# EAGLE schematic motherboard (EAGLE 9.5.2)
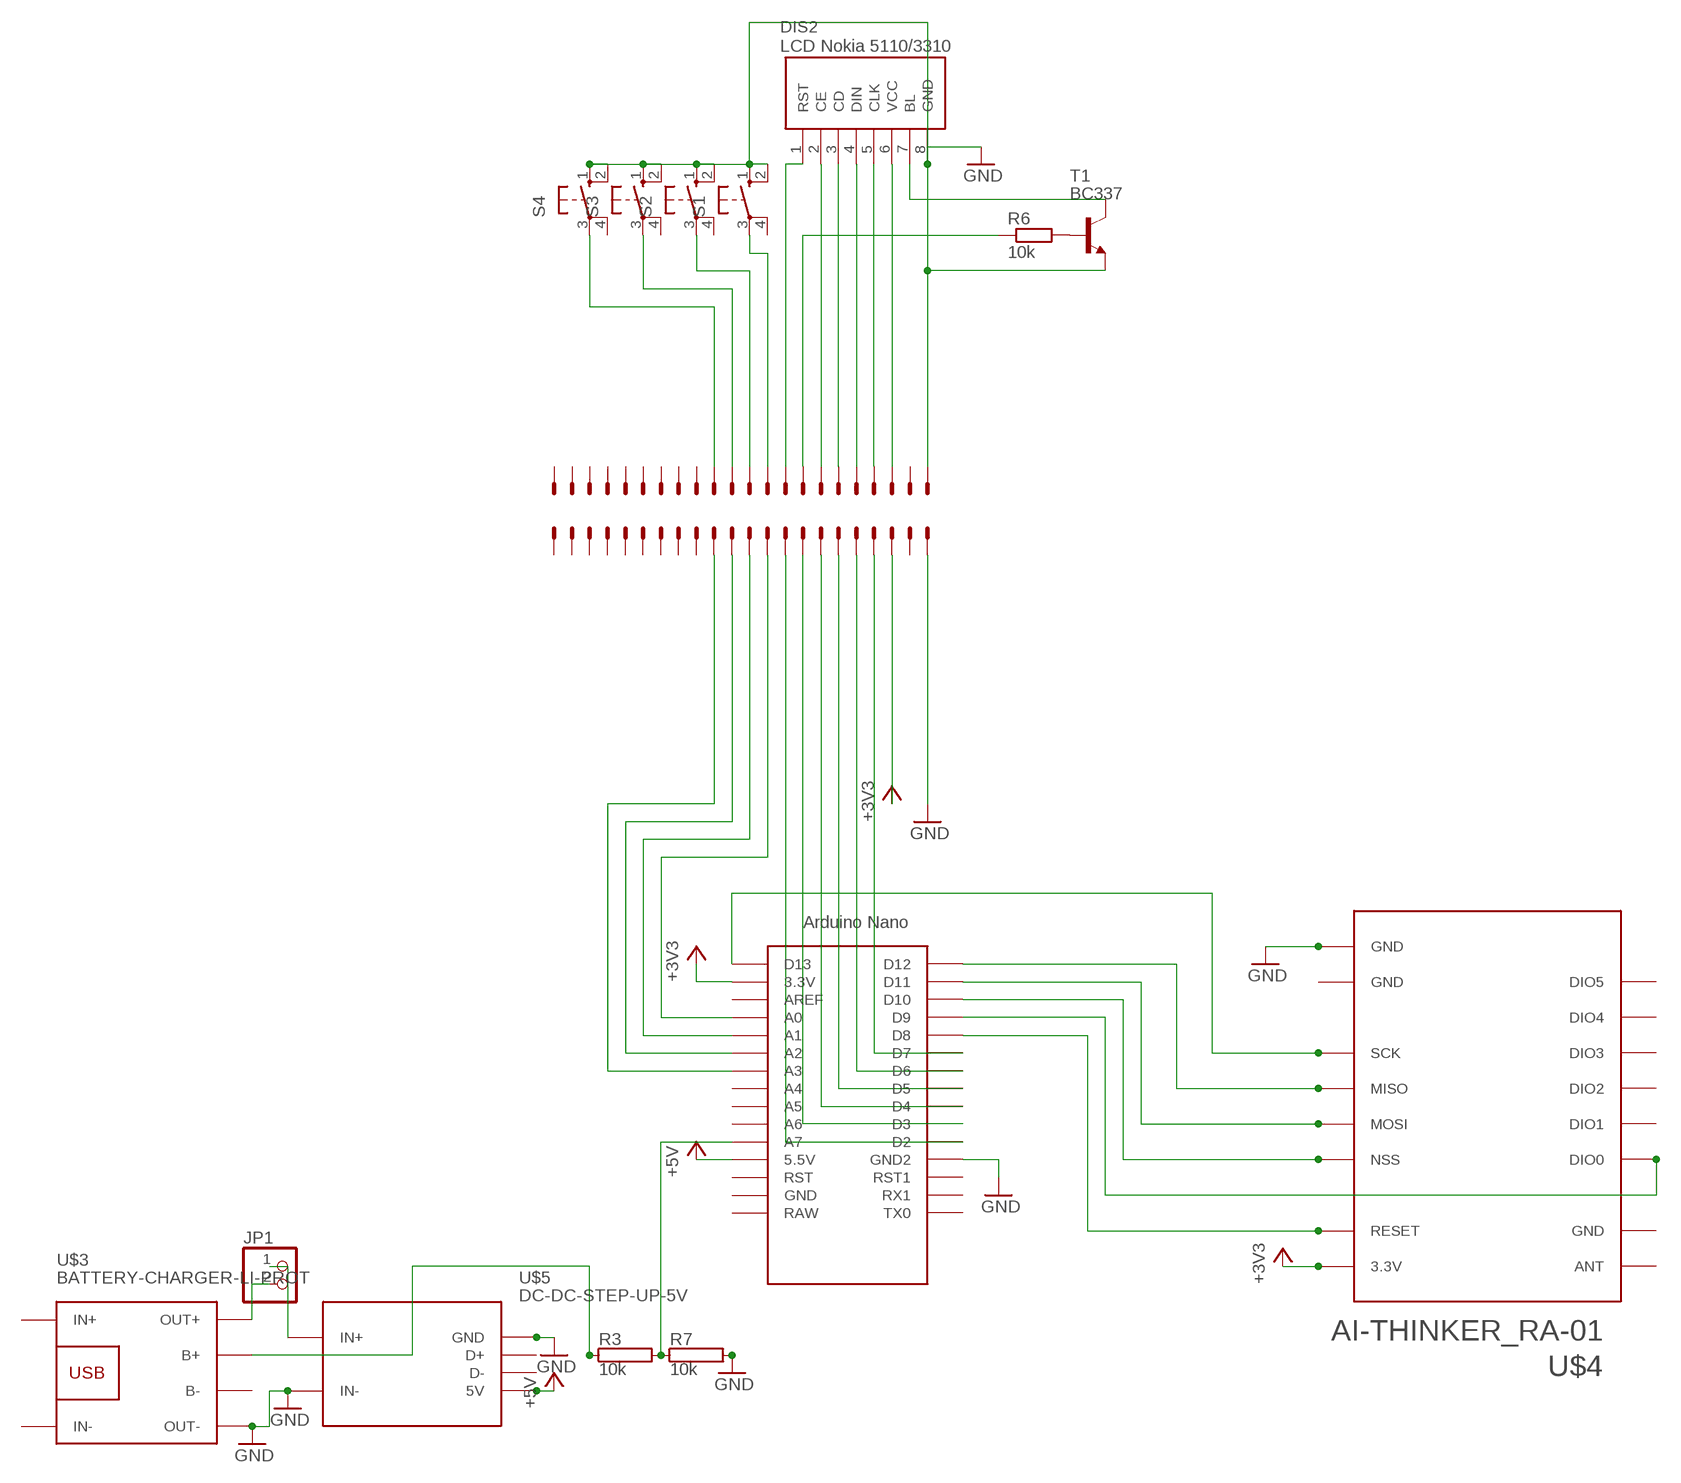
[diagram p0: schematic, sheet 1]

## Parts
DIS2  NOKIA5110  [NOKIA5110]
J1  XF2L-2235-1  [XF2L-2235-1]
J2  XF2L-2235-1  [XF2L-2235-1]
JP1  PINHD-1X2/90  [1X02/90]
R3  10k  RAC01  [AC01]
R6  10k  R-EU_0204/5  [0204/5]
R7  10k  RAC01  [AC01]
S1  10-XX  [B3F-10XX]
S2  10-XX  [B3F-10XX]
S3  10-XX  [B3F-10XX]
S4  10-XX  [B3F-10XX]
T1  BC337  [TO92]
U$1  NANO  [NANO]
U$3  BATTERY-CHARGER-LI-PROT  [BATTERY-CHARGER-LI-PROT]
U$4  AI-THINKER_RA-01  [AI-THINKER_RA-01]
U$5  DC-DC-STEP-UP-5V  [DC-DC-STEP-UP-5V]

## Nets
+3V3: J1.20 U$1.3.3V U$4.P$3(3.3V)
+5V: U$1.5V(5.5V) U$5.5V
GND: DIS2.8(GND) J1.22 J2.1 R7.2 S1.1(S) S1.2(S1) S2.1(S) S2.2(S1) S3.1(S) S3.2(S1) S4.1(S) S4.2(S1) T1.1(E) U$1.GND1(GND2) U$3.OUT- U$4.P$16(GND) U$5.GND U$5.IN-
N$1: JP1.1 U$5.IN+
N$2: U$1.D13 U$4.P$12(SCK)
N$3: J1.19 U$1.D7
N$4: U$1.D12 U$4.P$13(MISO)
N$5: U$1.D11 U$4.P$14(MOSI)
N$6: U$1.D10 U$4.P$15(NSS)
N$7: U$1.D9 U$4.P$5(DIO0)
N$8: U$1.D8 U$4.P$4(RESET)
N$9: J1.14 U$1.D2
N$10: J1.18 U$1.D6
N$11: J1.17 U$1.D5
N$12: J1.16 U$1.D4
N$13: J1.15 U$1.D3
N$14: R6.2 T1.2(B)
N$15: JP1.2 U$3.OUT+
N$16: R3.1 U$3.B+
N$17: DIS2.1(RST) J2.9
N$19: J2.8 R6.1
N$20: J2.10 S1.3(P)
N$21: J2.11 S2.3(P)
N$22: J2.12 S3.3(P)
N$23: DIS2.7(BL) T1.3(C)
N$24: R3.2 R7.1 U$1.A7
N$25: DIS2.6(VCC) J2.3
N$26: DIS2.5(CLK) J2.4
N$27: DIS2.4(DIN) J2.5
N$28: DIS2.3(CD) J2.6
N$29: DIS2.2(CE) J2.7
N$30: J2.13 S4.3(P)
N$32: J1.13 U$1.A0
N$33: J1.12 U$1.A1
N$34: J1.11 U$1.A2
N$35: J1.10 U$1.A3
Unconnected: J1.1 J1.2 J1.3 J1.4 J1.5 J1.6 J1.7 J1.8 J1.9 J1.21 J2.2 J2.14 J2.15 J2.16 J2.17 J2.18 J2.19 J2.20 J2.21 J2.22 S1.4(P1) S2.4(P1) S3.4(P1) S4.4(P1) U$1.A4 U$1.A5 U$1.A6 U$1.AREF U$1.GND U$1.ICSP1 U$1.ICSP2 U$1.ICSP3 U$1.ICSP4 U$1.ICSP5 U$1.ICSP6 U$1.RAW U$1.RST U$1.RST1 U$1.RX1 U$1.TX0 U$3.B- U$3.IN+ U$3.IN- U$4.P$1(ANT) U$4.P$2(GND) U$4.P$6(DIO1) U$4.P$7(DIO2) U$4.P$8(DIO3) U$4.P$9(GND) U$4.P$10(DIO4) U$4.P$11(DIO5) U$5.D+ U$5.D-

## Library data of the parts
DIS2 = _LCD_Nokia5110-minimal:NOKIA5110: Monochrome LCD Module from Nokia 5110/3310 with controller PCD8544. 8 pins x 2,54mm on bottom side. 45,5 mm x 42,5 mm
J1 J2 = con-omron:XF2*-22?: OMRON FPC Connector Source : http://www.omron.com/ecb/products/pdf/fpc.pdf; MPN: XF2L-2235-1A; OC_FARNELL: 1430930; OC_NEWARK: 05M2004
JP1 = pinhead:PINHD-1X2: PIN HEADER
R3 R7 = resistor-power:R: Power Resitor; OC_FARNELL: unknown; OC_NEWARK: unknown
R6 = rcl:R-EU_: RESISTOR, European symbol; SPICEPREFIX: R
S1-S4 = switch-omron:10-XX: OMRON SWITCH; MPN: B3F-1000; OC_FARNELL: 176432; OC_NEWARK: 36M3542
T1 = transistor:BC337: NPN TRANSISTOR
U$1 = Arduino-clone:NANO: Arduino Nano
U$3 = diy-modules:BATTERY-CHARGER-LI-PROT: Lithium Battery 5V Charger with protection circuit More details available here: http://www.instructables.com/id/DIY-Lithium-ion-Battery-Charger/step4/TP4056-based-lithium-ion-battery-charger-module/ Click here to find device on ebay.com <http://www.ebay.com/sch/tp4056+charger+usb+protection>
U$4 = lora-ra-02-minimal-because-labels-fuckup-rotating:AI-THINKER_RA-01
U$5 = 5v-step-up-minimal:DC-DC-STEP-UP-5V: DC/DC Step-Up Converter